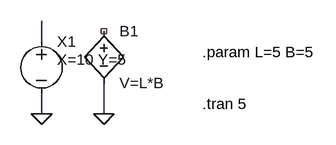
[diagram p0: schematic test_param_hierarchical_block.asc]
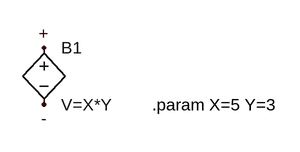
[diagram p1: sub-circuit param_test_hierarchical_block.asc]
test_param_hierarchical_block.asc, the LTspice schematic file:
Version 4
SHEET 1 880 680
WIRE 16 144 16 112
WIRE 16 256 16 224
WIRE 112 256 112 208
FLAG 112 256 0
FLAG 16 256 0
SYMBOL bv 112 112 R0
SYMATTR InstName B1
SYMATTR Value V=L*B
SYMBOL param_test_hierarchical_block 16 128 R0
WINDOW 39 24 44 Left 2
SYMATTR InstName X1
SYMATTR SpiceLine X=10 Y=5
TEXT 264 160 Left 2 !.param L=5 B=5
TEXT 264 240 Left 2 !.tran 5

param_test_hierarchical_block.asc, the sub-circuit schematic file:
Version 4
SHEET 1 880 680
FLAG 128 128 +
FLAG 128 208 -
SYMBOL bv 128 112 R0
SYMATTR InstName B1
SYMATTR Value V=X*Y
TEXT 280 208 Left 2 !.param X=5 Y=3

The netlist it stands for:
* test_param_hierarchical_block.asc
B1 NC_01 0 V=L*B
XX1 N001 0 param_test_hierarchical_block params: X=10 Y=5

* block symbol definitions
.subckt param_test_hierarchical_block + -
B1 + - V=X*Y
.param X=5 Y=3
.ends param_test_hierarchical_block

.param L=5 B=5
.tran 5
.backanno
.end